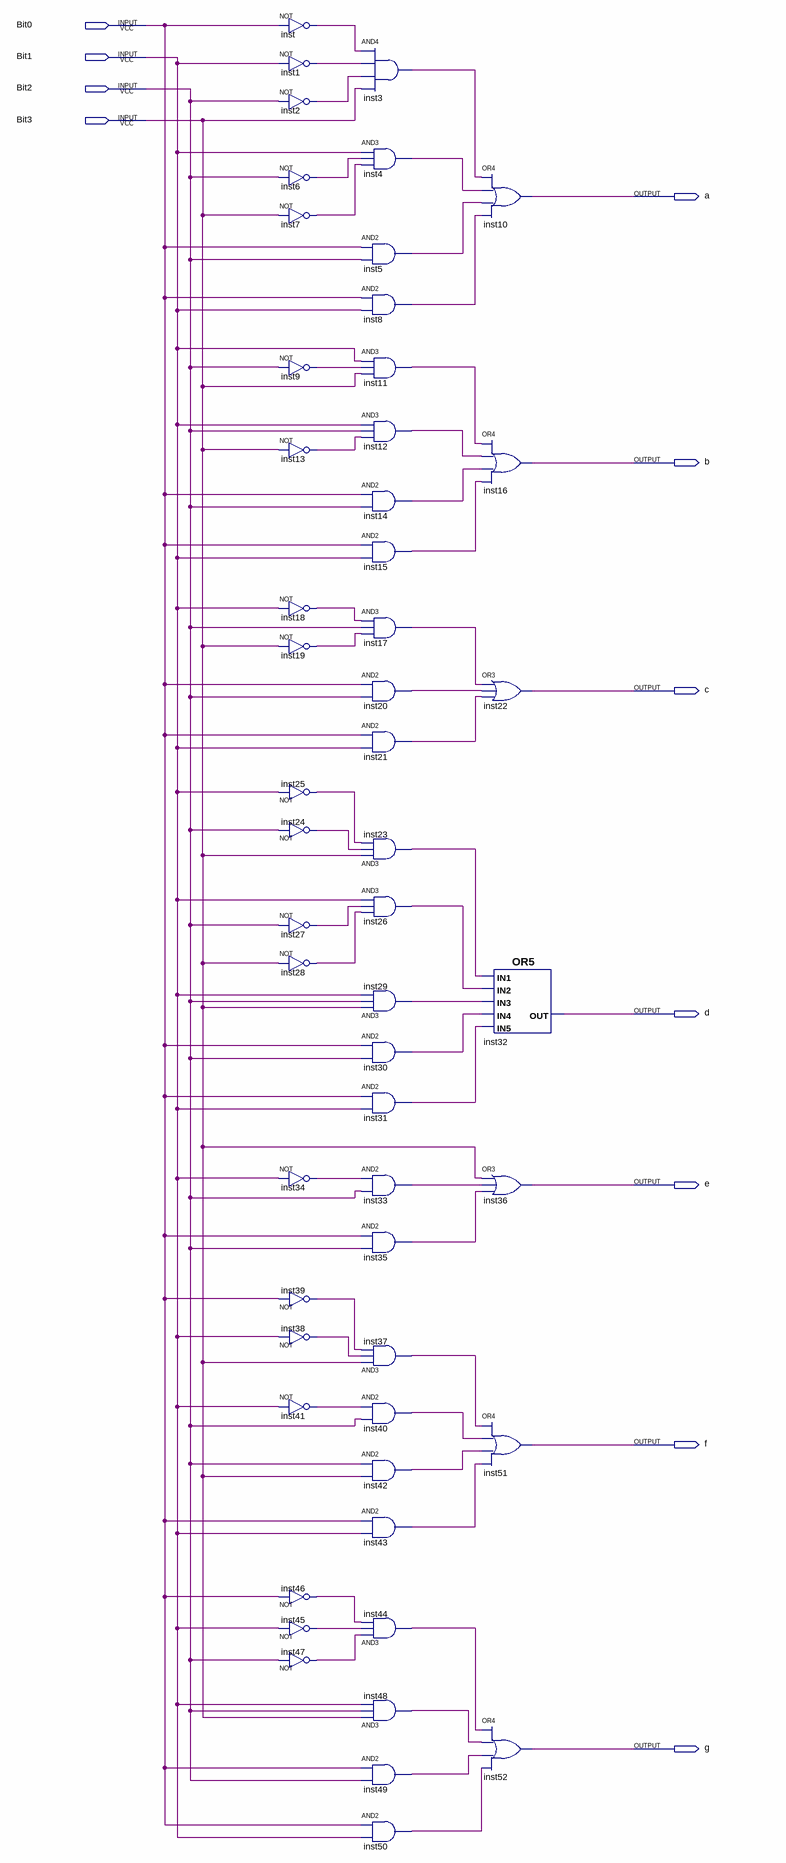
[diagram p0: schematic sheet]
// Quartus schematic decodificadorNumeros.bdf as structural Verilog: 53 symbols, 11 pins
module decodificadorNumeros (
  input  Bit0,
  input  Bit1,
  input  Bit2,
  input  Bit3,
  output a,
  output b,
  output c,
  output d,
  output e,
  output f,
  output g
);

  wire inst1_out, inst2_out, inst3_out, inst4_out, inst5_out, inst6_out, inst7_out, inst8_out, inst9_out,
       inst11_out, inst12_out, inst13_out, inst14_out, inst15_out, inst17_out, inst18_out, inst19_out,
       inst20_out, inst21_out, inst23_out, inst24_out, inst25_out, inst26_out, inst27_out, inst28_out,
       inst29_out, inst30_out, inst31_out, inst33_out, inst34_out, inst35_out, inst37_out, inst38_out,
       inst39_out, inst40_out, inst41_out, inst42_out, inst43_out, inst44_out, inst45_out, inst46_out,
       inst47_out, inst48_out, inst49_out, inst50_out, inst_out;

  not inst (inst_out, Bit0);
  not inst1 (inst1_out, Bit1);
  not inst2 (inst2_out, Bit2);
  not inst6 (inst6_out, Bit2);
  not inst7 (inst7_out, Bit3);
  not inst9 (inst9_out, Bit2);
  not inst13 (inst13_out, Bit3);
  not inst18 (inst18_out, Bit1);
  not inst19 (inst19_out, Bit3);
  not inst25 (inst25_out, Bit1);
  not inst24 (inst24_out, Bit2);
  not inst27 (inst27_out, Bit2);
  not inst28 (inst28_out, Bit3);
  not inst34 (inst34_out, Bit1);
  not inst39 (inst39_out, Bit0);
  not inst38 (inst38_out, Bit1);
  not inst41 (inst41_out, Bit1);
  not inst46 (inst46_out, Bit0);
  not inst45 (inst45_out, Bit1);
  not inst47 (inst47_out, Bit2);
  and inst3 (inst3_out, inst_out, inst1_out, inst2_out, Bit3);
  and inst4 (inst4_out, Bit1, inst6_out, inst7_out);
  and inst5 (inst5_out, Bit0, Bit2);
  and inst8 (inst8_out, Bit0, Bit1);
  and inst11 (inst11_out, Bit1, inst9_out, Bit3);
  and inst12 (inst12_out, Bit1, Bit2, inst13_out);
  and inst14 (inst14_out, Bit0, Bit2);
  and inst15 (inst15_out, Bit0, Bit1);
  and inst17 (inst17_out, inst18_out, Bit2, inst19_out);
  and inst20 (inst20_out, Bit0, Bit2);
  and inst21 (inst21_out, Bit0, Bit1);
  and inst23 (inst23_out, Bit3, inst24_out, inst25_out);
  and inst26 (inst26_out, Bit1, inst27_out, inst28_out);
  and inst29 (inst29_out, Bit3, Bit2, Bit1);
  and inst30 (inst30_out, Bit0, Bit2);
  and inst31 (inst31_out, Bit0, Bit1);
  and inst33 (inst33_out, inst34_out, Bit2);
  and inst35 (inst35_out, Bit0, Bit2);
  and inst37 (inst37_out, Bit3, inst38_out, inst39_out);
  and inst40 (inst40_out, inst41_out, Bit2);
  and inst42 (inst42_out, Bit2, Bit3);
  and inst43 (inst43_out, Bit0, Bit1);
  and inst44 (inst44_out, inst47_out, inst45_out, inst46_out);
  and inst48 (inst48_out, Bit3, Bit2, Bit1);
  and inst49 (inst49_out, Bit0, Bit2);
  and inst50 (inst50_out, Bit0, Bit1);
  or inst10 (a, inst3_out, inst4_out, inst5_out, inst8_out);
  or inst16 (b, inst11_out, inst12_out, inst14_out, inst15_out);
  or inst22 (c, inst17_out, inst20_out, inst21_out);
  or inst32 (d, inst23_out, inst26_out, inst29_out, inst30_out, inst31_out);
  or inst36 (e, Bit3, inst33_out, inst35_out);
  or inst51 (f, inst37_out, inst40_out, inst42_out, inst43_out);
  or inst52 (g, inst44_out, inst48_out, inst49_out, inst50_out);
endmodule
